# Altium schematic sheet GNSS.SchDoc
size A4
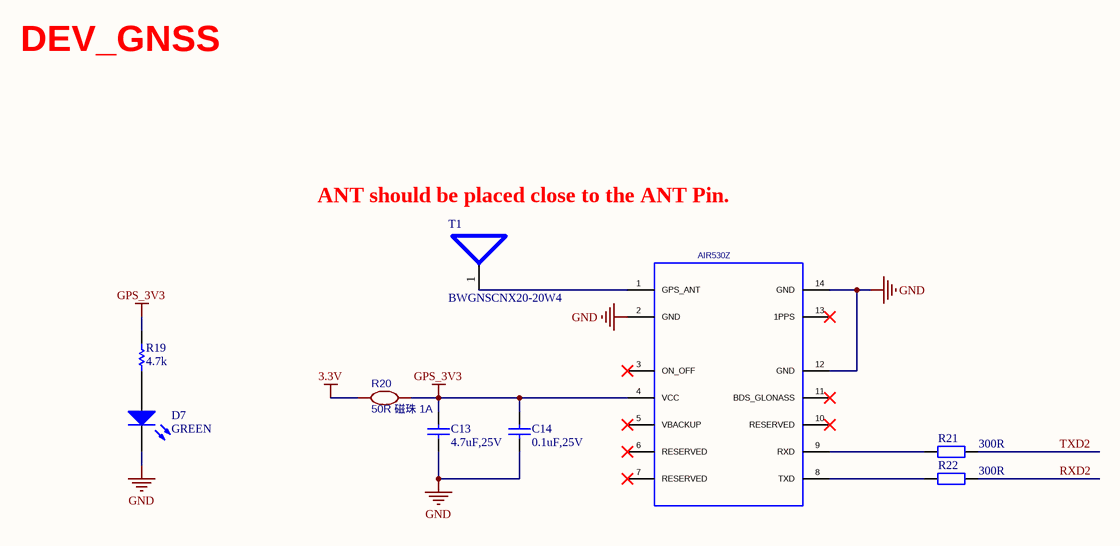
[diagram p0: GNSS.SchDoc]

## Parts
C13  value 4.7uF,25V  [0402_C]  (hidden comment: Cap)
C14  value 0.1uF,25V  [0402_C]  (hidden comment: Cap)
D7  value GREEN  [0603_LED]  (hidden comment: LED)
R19  value 4.7k  [0603_R]  (hidden comment: Res_5%)
R20  50R 磁珠 1A  [0402_R]
R21  value 300R  [0603_R]  (hidden comment: Res)
R22  value 300R  [0603_R]  (hidden comment: Res)
T1  BWGNSCNX20-20W4  [ANT-TH_BWGNSCNX20-20W4]
U5  AIR530Z  [AIR530]

## Nets
3.3V: R20.2
GND: C13.2 C14.2 D7.2(K) U5.2(GND) U5.12(GND) U5.14(GND)
GPS_3V3: C13.1 C14.1 R19.2 R20.1 U5.4(VCC)
RXD2: R22.2
TXD2: R21.2
NetD7_1: D7.1(A) R19.1
NetR21_1: R21.1 U5.9(RXD)
NetR22_1: R22.1 U5.8(TXD)
NetT1_1: T1.1 U5.1(GPS_ANT)

Not connected (* = marked no-connect by the designer): U5 3(ON_OFF)* 5(VBACKUP)* 6(RESERVED)* 7(RESERVED)* 10(RESERVED)* 11(BDS_GLONASS)* 13(1PPS)*

## Notes on the sheet
- DEV_GNSS
- ANT should be placed close to the ANT Pin.

## Library data of the parts
C13 C14 = T_Cap_0603_0.1uF_25V_X5R: 贴片电容; Part Typer: X5R; Solder: SMD; Withstand Voltage: 25V; Tolerance: 10%; Schematic Path: X:\Database\Schematic Library.Schlib; Part Number: T_Cap_0603_0.1uF_25V_X5R; LibRef: T_Cap_0603_0.1uF_25V_X5R
D7 = T_LED_Red_0805: 红色LED灯; Solder: SMD; Schematic Path: X:\Database\Schematic Library.Schlib; Part Number: T_LED_Red_0805; LibRef: T_LED_Red_0805
R19 = T_Res_0603_10k_5%_1/10W: 贴片电阻; Solder: SMD; Power: 1/10W; Tolerance: 5%; Schematic Path: X:\Database\Schematic Library.Schlib; Part Number: T_Res_0603_10k_5%_1/10W; LibRef: T_Res_0603_10k_5%_1/10W
R20 = 100k: nameAlias: Value(Ω); Contributor: LCEDA_Lib; spicePre: R; spiceSymbolName: R_0603_EU
R21 R22 = T_Res_0603_49.9k_1%_1/10W: 贴片电阻; Solder: SMD; Power: 1/10W; Tolerance: 1%; Schematic Path: X:\Database\Schematic Library.Schlib; Part Number: T_Res_0603_49.9k_1%_1/10W; LibRef: T_Res_0603_49.9k_1%_1/10W
T1 = ANT
U5 = AIR530Z: GPS/Beidou/GLONASS module;9.9*12.9*2.3mm; Manufacture: Luat; Geometry.Height: 2.3mm; Manufacturer P/N: Air530Z; PCB DECAL: AIR530